# EAGLE schematic voice-card-controller-1 (EAGLE 7.2.0)
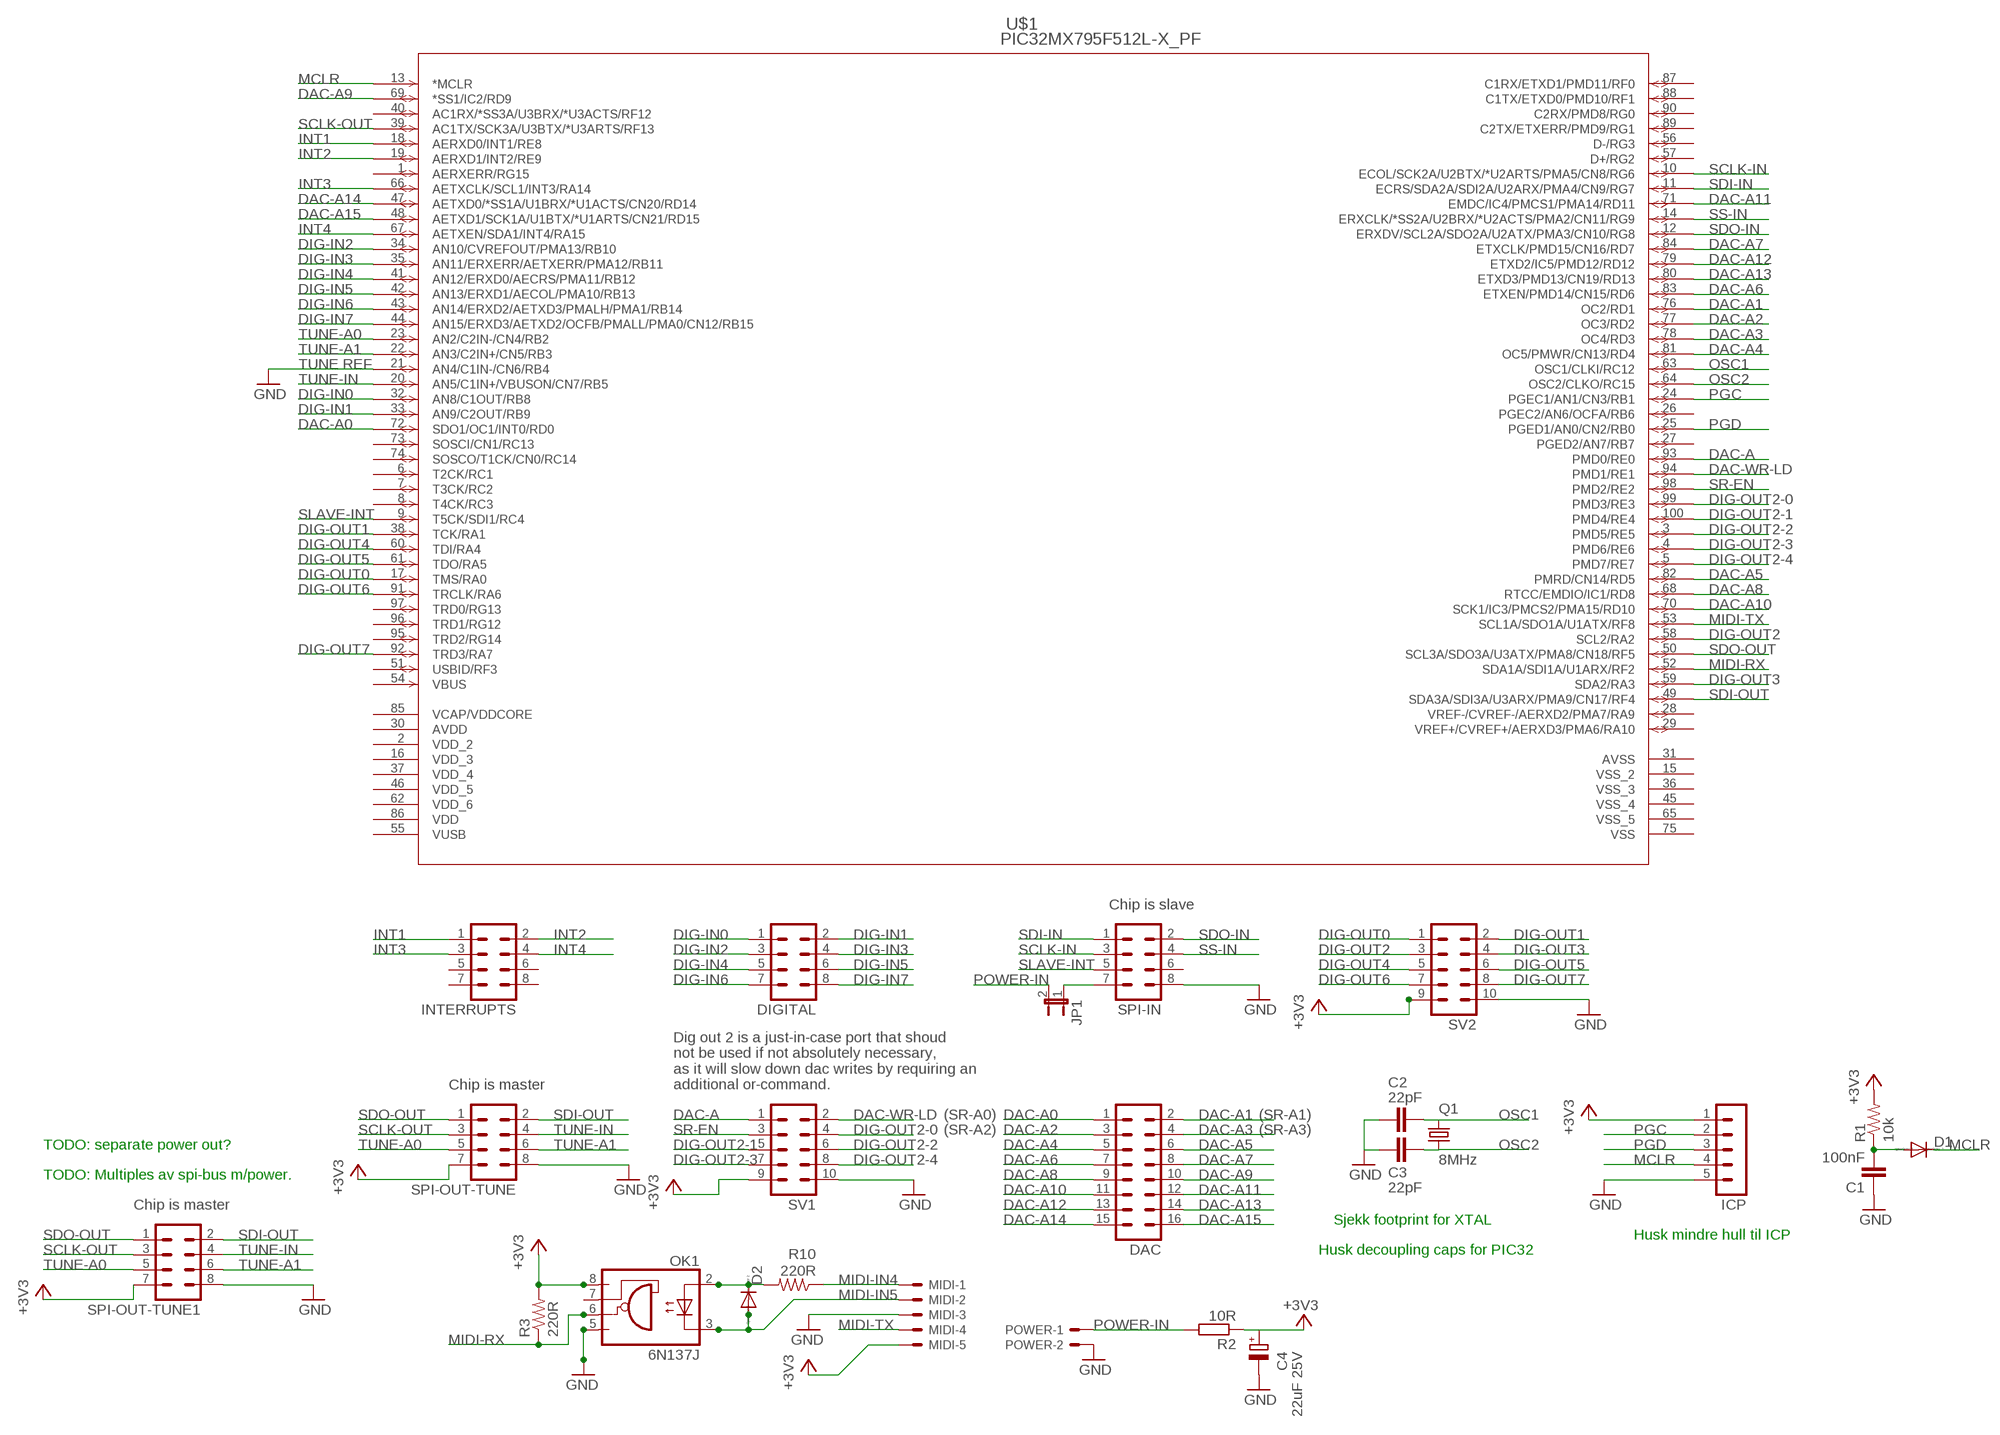
[diagram p0: schematic, sheet 1]

## Parts
C1  100nF  C-EUC0805  [C0805]
C2  22pF  C-EUC0805  [C0805]
C3  22pF  C-EUC0805  [C0805]
C4  22uF 25V  CPOL-EUE2.5-5  [E2,5-5]
D1  DIODE-SOD80C  [SOD80C]
D2  DIODE-SOD80C  [SOD80C]
DAC  MA08-2  [MA08-2]
DIGITAL  MA04-2  [MA04-2]
ICP  MA05-1  [MA05-1]
INTERRUPTS  MA04-2  [MA04-2]
JP1  JP1E  [JP1]
MIDI  22-23-2051  [22-23-2051]
OK1  6N137J  [DIL08-J]
POWER  22-23-2021  [22-23-2021]
Q1  8MHz  CRYSTALSM49  [SM49]
R1  10k  R-US_R0805  [R0805]
R2  10R  R-EU_0207/7  [0207/7]
R3  220R  R-US_R0805  [R0805]
R10  220R  R-US_R0805  [R0805]
SPI-IN  MA04-2  [MA04-2]
SPI-OUT-TUNE  MA04-2  [MA04-2]
SPI-OUT-TUNE1  MA04-2  [MA04-2]
SV1  MA05-2  [MA05-2]
SV2  MA05-2  [MA05-2]
U$1  PIC32MX795F512L-X_PF  [TQFP100_14X14MC]

## Nets
+3V3: C4.+ ICP.1 MIDI.5 OK1.8(VCC) R1.2 R2.1 R3.2 SPI-OUT-TUNE1.7 SPI-OUT-TUNE.7 SV1.9 SV2.9
DAC-A: SV1.1 U$1.93(PMD0/RE0)
DAC-A0: DAC.1 U$1.72(SDO1/OC1/INT0/RD0)
DAC-A1: DAC.2 U$1.76(OC2/RD1)
DAC-A2: DAC.3 U$1.77(OC3/RD2)
DAC-A3: DAC.4 U$1.78(OC4/RD3)
DAC-A4: DAC.5 U$1.81(OC5/PMWR/CN13/RD4)
DAC-A5: DAC.6 U$1.82(PMRD/CN14/RD5)
DAC-A6: DAC.7 U$1.83(ETXEN/PMD14/CN15/RD6)
DAC-A7: DAC.8 U$1.84(ETXCLK/PMD15/CN16/RD7)
DAC-A8: DAC.9 U$1.68(RTCC/EMDIO/IC1/RD8)
DAC-A9: DAC.10 U$1.69(*SS1/IC2/RD9)
DAC-A10: DAC.11 U$1.70(SCK1/IC3/PMCS2/PMA15/RD10)
DAC-A11: DAC.12 U$1.71(EMDC/IC4/PMCS1/PMA14/RD11)
DAC-A12: DAC.13 U$1.79(ETXD2/IC5/PMD12/RD12)
DAC-A13: DAC.14 U$1.80(ETXD3/PMD13/CN19/RD13)
DAC-A14: DAC.15 U$1.47(AETXD0/*SS1A/U1BRX/*U1ACTS/CN20/RD14)
DAC-A15: DAC.16 U$1.48(AETXD1/SCK1A/U1BTX/*U1ARTS/CN21/RD15)
DAC-WR-LD: SV1.2 U$1.94(PMD1/RE1)
DIG-IN0: DIGITAL.1 U$1.32(AN8/C1OUT/RB8)
DIG-IN1: DIGITAL.2 U$1.33(AN9/C2OUT/RB9)
DIG-IN2: DIGITAL.3 U$1.34(AN10/CVREFOUT/PMA13/RB10)
DIG-IN3: DIGITAL.4 U$1.35(AN11/ERXERR/AETXERR/PMA12/RB11)
DIG-IN4: DIGITAL.5 U$1.41(AN12/ERXD0/AECRS/PMA11/RB12)
DIG-IN5: DIGITAL.6 U$1.42(AN13/ERXD1/AECOL/PMA10/RB13)
DIG-IN6: DIGITAL.7 U$1.43(AN14/ERXD2/AETXD3/PMALH/PMA1/RB14)
DIG-IN7: DIGITAL.8 U$1.44(AN15/ERXD3/AETXD2/OCFB/PMALL/PMA0/CN12/RB15)
DIG-OUT0: SV2.1 U$1.17(TMS/RA0)
DIG-OUT1: SV2.2 U$1.38(TCK/RA1)
DIG-OUT2: SV2.3 U$1.58(SCL2/RA2)
DIG-OUT2-0: SV1.4 U$1.99(PMD3/RE3)
DIG-OUT2-1: SV1.5 U$1.100(PMD4/RE4)
DIG-OUT2-2: SV1.6 U$1.3(PMD5/RE5)
DIG-OUT2-3: SV1.7 U$1.4(PMD6/RE6)
DIG-OUT2-4: SV1.8 U$1.5(PMD7/RE7)
DIG-OUT3: SV2.4 U$1.59(SDA2/RA3)
DIG-OUT4: SV2.5 U$1.60(TDI/RA4)
DIG-OUT5: SV2.6 U$1.61(TDO/RA5)
DIG-OUT6: SV2.7 U$1.91(TRCLK/RA6)
DIG-OUT7: SV2.8 U$1.92(TRD3/RA7)
GND: C1.1 C2.2 C3.2 C4.- ICP.5 MIDI.3 OK1.5(GND) POWER.2 SPI-IN.8 SPI-OUT-TUNE1.8 SPI-OUT-TUNE.8 SV1.10 SV2.10 U$1.21(AN4/C1IN-/CN6/RB4)
INT1: INTERRUPTS.1 U$1.18(AERXD0/INT1/RE8)
INT2: INTERRUPTS.2 U$1.19(AERXD1/INT2/RE9)
INT3: INTERRUPTS.3 U$1.66(AETXCLK/SCL1/INT3/RA14)
INT4: INTERRUPTS.4 U$1.67(AETXEN/SDA1/INT4/RA15)
MCLR: D1.C ICP.4 U$1.13(*MCLR)
MIDI-IN4: MIDI.1 R10.1
MIDI-IN5: D2.A MIDI.2 OK1.3(C)
MIDI-RX: OK1.6(VO) R3.1 U$1.52(SDA1A/SDI1A/U1ARX/RF2)
MIDI-TX: MIDI.4 U$1.53(SCL1A/SDO1A/U1ATX/RF8)
N$2: JP1.1 SPI-IN.7
N$4: C1.2 D1.A R1.1
N$5: D2.C OK1.2(A) R10.2
OSC1: C2.1 Q1.2 U$1.63(OSC1/CLKI/RC12)
OSC2: C3.1 Q1.1 U$1.64(OSC2/CLKO/RC15)
PGC: ICP.2 U$1.24(PGEC1/AN1/CN3/RB1)
PGD: ICP.3 U$1.25(PGED1/AN0/CN2/RB0)
POWER-IN: JP1.2 POWER.1 R2.2
SCLK-IN: SPI-IN.3 U$1.10(ECOL/SCK2A/U2BTX/*U2ARTS/PMA5/CN8/RG6)
SCLK-OUT: SPI-OUT-TUNE1.3 SPI-OUT-TUNE.3 U$1.39(AC1TX/SCK3A/U3BTX/*U3ARTS/RF13)
SDI-IN: SPI-IN.1 U$1.11(ECRS/SDA2A/SDI2A/U2ARX/PMA4/CN9/RG7)
SDI-OUT: SPI-OUT-TUNE1.2 SPI-OUT-TUNE.2 U$1.49(SDA3A/SDI3A/U3ARX/PMA9/CN17/RF4)
SDO-IN: SPI-IN.2 U$1.12(ERXDV/SCL2A/SDO2A/U2ATX/PMA3/CN10/RG8)
SDO-OUT: SPI-OUT-TUNE1.1 SPI-OUT-TUNE.1 U$1.50(SCL3A/SDO3A/U3ATX/PMA8/CN18/RF5)
SLAVE-INT: SPI-IN.5 U$1.9(T5CK/SDI1/RC4)
SR-EN: SV1.3 U$1.98(PMD2/RE2)
SS-IN: SPI-IN.4 U$1.14(ERXCLK/*SS2A/U2BRX/*U2ACTS/PMA2/CN11/RG9)
TUNE-A0: SPI-OUT-TUNE1.5 SPI-OUT-TUNE.5 U$1.23(AN2/C2IN-/CN4/RB2)
TUNE-A1: SPI-OUT-TUNE1.6 SPI-OUT-TUNE.6 U$1.22(AN3/C2IN+/CN5/RB3)
TUNE-IN: SPI-OUT-TUNE1.4 SPI-OUT-TUNE.4 U$1.20(AN5/C1IN+/VBUSON/CN7/RB5)
Unconnected: INTERRUPTS.5 INTERRUPTS.6 INTERRUPTS.7 INTERRUPTS.8 OK1.7(VE) SPI-IN.6 U$1.1(AERXERR/RG15) U$1.6(T2CK/RC1) U$1.7(T3CK/RC2) U$1.8(T4CK/RC3) U$1.26(PGEC2/AN6/OCFA/RB6) U$1.27(PGED2/AN7/RB7) U$1.28(VREF-/CVREF-/AERXD2/PMA7/RA9) U$1.29(VREF+/CVREF+/AERXD3/PMA6/RA10) U$1.40(AC1RX/*SS3A/U3BRX/*U3ACTS/RF12) U$1.51(USBID/RF3) U$1.54(VBUS) U$1.56(D-/RG3) U$1.57(D+/RG2) U$1.73(SOSCI/CN1/RC13) U$1.74(SOSCO/T1CK/CN0/RC14) U$1.87(C1RX/ETXD1/PMD11/RF0) U$1.88(C1TX/ETXD0/PMD10/RF1) U$1.89(C2TX/ETXERR/PMD9/RG1) U$1.90(C2RX/PMD8/RG0) U$1.95(TRD2/RG14) U$1.96(TRD1/RG12) U$1.97(TRD0/RG13)

## Notes on the sheet
- TUNE REF
- Chip is slave
- Chip is master
- Dig out 2 is a just-in-case port that shoud
  not be used if not absolutely necessary,
  as it will slow down dac writes by requiring an 
  additional or-command.
- (SR-A0) | (SR-A1)
- (SR-A2) | (SR-A3)
- TODO: separate power out?
- TODO: Multiples av spi-bus m/power.
- Chip is master
- Sjekk footprint for XTAL
- Husk mindre hull til ICP
- Husk decoupling caps for PIC32

## Power pins joined to a net without a drawn wire
AVDD: U$1.30(AVDD)
AVSS: U$1.31(AVSS)
VCAP/VDDCORE: U$1.85(VCAP/VDDCORE)
VDD: U$1.86(VDD)
VDD_2: U$1.2(VDD_2)
VDD_3: U$1.16(VDD_3)
VDD_4: U$1.37(VDD_4)
VDD_5: U$1.46(VDD_5)
VDD_6: U$1.62(VDD_6)
VSS: U$1.75(VSS)
VSS_2: U$1.15(VSS_2)
VSS_3: U$1.36(VSS_3)
VSS_4: U$1.45(VSS_4)
VSS_5: U$1.65(VSS_5)
VUSB: U$1.55(VUSB)

## Library data of the parts
C1-C3 = resistor:C-EU: CAPACITOR, European symbol
C4 = resistor:CPOL-EU: POLARIZED CAPACITOR, European symbol
D1 D2 = diode:DIODE-: DIODE
DAC = con-lstb:MA08-2: PIN HEADER; OC_FARNELL: unknown; OC_NEWARK: unknown
DIGITAL INTERRUPTS SPI-IN SPI-OUT-TUNE SPI-OUT-TUNE1 = con-lstb:MA04-2: PIN HEADER; OC_FARNELL: unknown; OC_NEWARK: unknown
ICP = joakim:MA05-1: PIN HEADER; OC_FARNELL: unknown; OC_NEWARK: unknown
JP1 = jumper:JP1E: JUMPER
MIDI = con-molex:22-23-2051: .100" (2.54mm) Center Header - 5 Pin; MF: MOLEX; MPN: 22-23-2051; OC_FARNELL: 1462952; OC_NEWARK: 38C9178
OK1 = joakim:6N137: MOTOROLA OPTO COUPLER
POWER = con-molex:22-23-2021: .100" (2.54mm) Center Header - 2 Pin; MF: MOLEX; MPN: 22-23-2021; OC_FARNELL: 1462926; OC_NEWARK: 25C3832
Q1 = crystal:CRYSTAL: CRYSTAL; OC_FARNELL: unknown; OC_NEWARK: unknown
R1 R3 R10 = resistor:R-US_: RESISTOR, American symbol
R2 = resistor:R-EU_: RESISTOR, European symbol
SV1 SV2 = con-lstb:MA05-2: PIN HEADER; OC_FARNELL: unknown; OC_NEWARK: unknown
U$1 = pic32mx-795F-512L:PIC32MX795F512L-X_PF